# Altium schematic sheet filterbank_amp.SchDoc
size A3
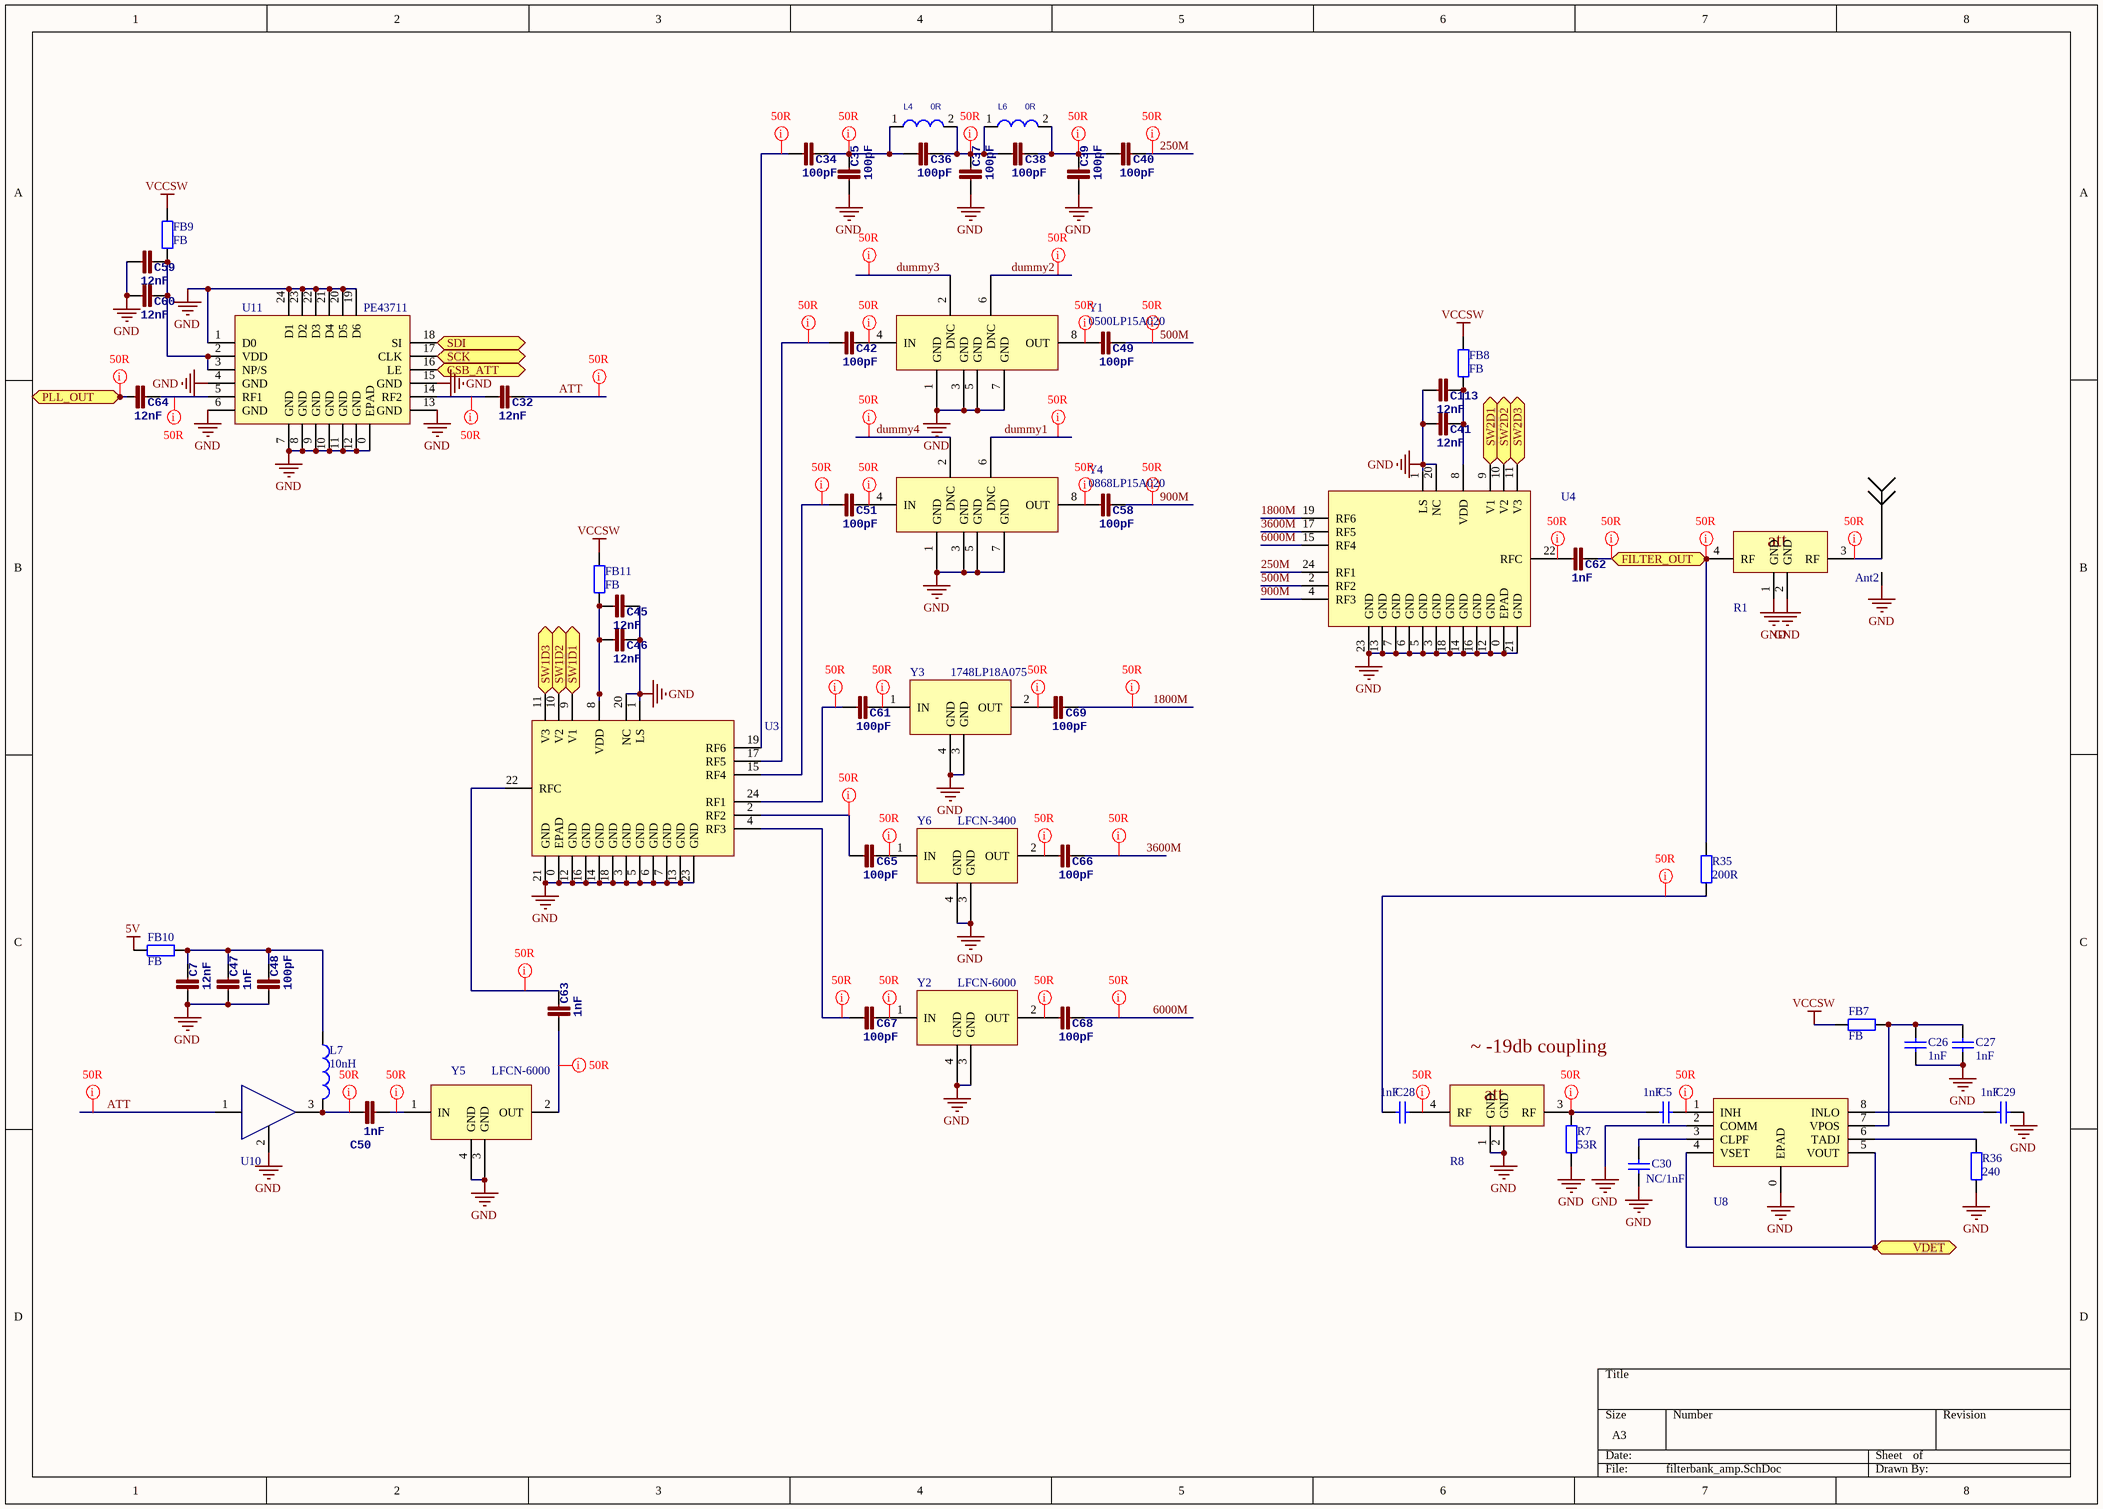
[diagram p0: filterbank_amp.SchDoc]

## Parts
Ant2  Antenna  [SMA-2]  (value not drawn)
C5  1nF  [0402]
C7  12nF  [0805]
C26  1nF  [0402]
C27  1nF  [0402]
C28  1nF  [0402]
C29  1nF  [0402]
C30  NC/1nF  [0402]
C32  12nF  [0402]
C34  100pF  [0402]
C35  100pF  [0402]
C36  100pF  [0402]
C37  100pF  [0402]
C38  100pF  [0402]
C39  100pF  [0402]
C40  100pF  [0402]
C41  12nF  [0402]
C42  100pF  [0402]
C45  12nF  [0402]
C46  12nF  [0402]
C47  1nF  [0402]
C48  100pF  [0402]
C49  100pF  [0402]
C50  1nF  [0402]
C51  100pF  [0402]
C58  100pF  [0402]
C59  12nF  [0402]
C60  12nF  [0402]
C61  100pF  [0402]
C62  1nF  [0402]
C63  1nF  [0402]
C64  12nF  [0402]
C65  100pF  [0402]
C66  100pF  [0402]
C67  100pF  [0402]
C68  100pF  [0402]
C69  100pF  [0402]
C113  12nF  [0402]
FB7  FB  [0402]
FB8  FB  [0402]
FB9  FB  [0402]
FB10  FB  [0402]
FB11  FB  [0402]
L4  0R  [0402]
L6  0R  [0402]
L7  value 10nH  [0402]  (hidden comment: Inductor)
R1  EXB24-RF-ATT  [EXB24AT-RF-ATT]  (value not drawn)
R7  53R  [0402]
R8  EXB24-RF-ATT  [EXB24AT-RF-ATT]  (value not drawn)
R35  200R  [0402]
R36  240  [0402]
U3  PE42462  [PE42462]  (value not drawn)
U4  PE42462  [PE42462]  (value not drawn)
U8  AD8319  [AD8319]  (value not drawn)
U10  AMP-SOT89  [SOT-89]  (value not drawn)
U11  PE43711  [PE43711]
Y1  0500LP15A020  [5515LP15A730/0868LP15A020]
Y2  LFCN-6000  [1748LP18A075]
Y3  1748LP18A075  [1748LP18A075]
Y4  0868LP15A020  [5515LP15A730/0868LP15A020]
Y5  LFCN-6000  [1748LP18A075]
Y6  LFCN-3400  [1748LP18A075]

## Ports
CSB_ATT, FILTER_OUT, PLL_OUT, SCK, SDI, SW1D1, SW1D2, SW1D3, SW2D1, SW2D2, SW2D3, VDET

## Nets
5V: FB10.1
GND: Ant2.GND(G) C7.1 C26.1 C27.1 C29.2 C30.1 C35.1 C37.1 C39.1 C41.1 C45.2 C46.2 C47.1 C48.1 C59.1 C60.1 C113.1 R1.1(GND) R1.2(GND) R7.2 R8.1(GND) R8.2(GND) R36.2 U3.0(EPAD) U3.1(LS) U3.3(GND) U3.5(GND) U3.6(GND) U3.7(GND) U3.12(GND) U3.13(GND) U3.14(GND) U3.16(GND) U3.18(GND) U3.20(NC) U3.21(GND) U3.23(GND) U4.0(EPAD) U4.1(LS) U4.3(GND) U4.5(GND) U4.6(GND) U4.7(GND) U4.12(GND) U4.13(GND) U4.14(GND) U4.16(GND) U4.18(GND) U4.20(NC) U4.21(GND) U4.23(GND) U8.0(EPAD) U8.2(COMM) U10.2 U11.0(EPAD) U11.1(D0) U11.4(GND) U11.6(GND) U11.7(GND) U11.8(GND) U11.9(GND) U11.10(GND) U11.11(GND) U11.12(GND) U11.13(GND) U11.15(GND) U11.19(D6) U11.20(D5) U11.21(D4) U11.22(D3) U11.23(D2) U11.24(D1) Y1.1(GND) Y1.3(GND) Y1.5(GND) Y1.7(GND) Y2.3(GND) Y2.4(GND) Y3.3(GND) Y3.4(GND) Y4.1(GND) Y4.3(GND) Y4.5(GND) Y4.7(GND) Y5.3(GND) Y5.4(GND) Y6.3(GND) Y6.4(GND)
VCCSW: FB7.1 FB8.2 FB9.2 FB11.2
250M: C40.2 U4.24(RF1)
500M: C49.2 U4.2(RF2)
900M: C58.2 U4.4(RF3)
1800M: C69.2 U4.19(RF6)
3600M: C66.2 U4.17(RF5)
6000M: C68.2 U4.15(RF4)
ATT: C32.2 U10.1
CSB_ATT: U11.16(LE) ; port CSB_ATT
dummy1: Y4.6(DNC)
dummy2: Y1.6(DNC)
dummy3: Y1.2(DNC)
dummy4: Y4.2(DNC)
FILTER_OUT: C62.2 R1.4(RF) R35.1 ; port FILTER_OUT
PLL_OUT: C64.1 ; port PLL_OUT
SCK: U11.17(CLK) ; port SCK
SDI: U11.18(SI) ; port SDI
SW1D1: U3.9(V1) ; port SW1D1
SW1D2: U3.10(V2) ; port SW1D2
SW1D3: U3.11(V3) ; port SW1D3
SW2D1: U4.9(V1) ; port SW2D1
SW2D2: U4.10(V2) ; port SW2D2
SW2D3: U4.11(V3) ; port SW2D3
VDET: U8.4(VSET) U8.5(VOUT) ; port VDET
NetAnt2_1: Ant2.1 R1.3(RF)
NetC5_1: C5.1 R7.1 R8.3(RF)
NetC5_2: C5.2 U8.1(INH)
NetC7_2: C7.2 C47.2 C48.2 FB10.2 L7.1
NetC26_2: C26.2 C27.2 FB7.2 U8.7(VPOS)
NetC28_1: C28.1 R35.2
NetC28_2: C28.2 R8.4(RF)
NetC29_1: C29.1 U8.8(INLO)
NetC30_2: C30.2 U8.3(CLPF)
NetC32_1: C32.1 U11.14(RF2)
NetC34_1: C34.1 U3.19(RF6)
NetC34_2: C34.2 C35.2 C36.1 L4.1
NetC36_2: C36.2 C37.2 C38.1 L4.2 L6.1
NetC38_2: C38.2 C39.2 C40.1 L6.2
NetC41_2: C41.2 C113.2 FB8.1 U4.8(VDD)
NetC42_1: C42.1 U3.17(RF5)
NetC42_2: C42.2 Y1.4(IN)
NetC45_1: C45.1 C46.1 FB11.1 U3.8(VDD)
NetC49_1: C49.1 Y1.8(OUT)
NetC50_1: C50.1 L7.2 U10.3
NetC50_2: C50.2 Y5.1(IN)
NetC51_1: C51.1 U3.15(RF4)
NetC51_2: C51.2 Y4.4(IN)
NetC58_1: C58.1 Y4.8(OUT)
NetC59_2: C59.2 C60.2 FB9.1 U11.2(VDD) U11.3(NP/S)
NetC61_1: C61.1 U3.24(RF1)
NetC61_2: C61.2 Y3.1(IN)
NetC62_1: C62.1 U4.22(RFC)
NetC63_1: C63.1 Y5.2(OUT)
NetC63_2: C63.2 U3.22(RFC)
NetC64_2: C64.2 U11.5(RF1)
NetC65_1: C65.1 U3.2(RF2)
NetC65_2: C65.2 Y6.1(IN)
NetC66_1: C66.1 Y6.2(OUT)
NetC67_1: C67.1 U3.4(RF3)
NetC67_2: C67.2 Y2.1(IN)
NetC68_1: C68.1 Y2.2(OUT)
NetC69_1: C69.1 Y3.2(OUT)
NetR36_1: R36.1 U8.6(TADJ)

## Layout directives
net class 50R: 250M, 500M, 900M, 1800M, 3600M, 6000M, ATT, dummy1, dummy2, dummy3, dummy4, FILTER_OUT, NetAnt2_1, NetC5_1, NetC5_2, NetC28_1, NetC28_2, NetC32_1, NetC34_1, NetC34_2, NetC36_2, NetC38_2, NetC42_1, NetC42_2, NetC49_1, NetC50_1, NetC50_2, NetC51_1, NetC51_2, NetC58_1, NetC61_1, NetC61_2, NetC62_1, NetC63_1, NetC63_2, NetC64_2, NetC65_1, NetC65_2, NetC66_1, NetC67_1, NetC67_2, NetC68_1, NetC69_1, PLL_OUT

## Notes on the sheet
- ~ -19db coupling
- (in symbol EXB24-RF-ATT) att

## Library data of the parts
C5 C26-C30 = Cap: Capacitor; Published: 8-Jun-2000; LatestRevisionDate: 17-Jul-2002; LatestRevisionNote: Re-released for DXP Platform.; PackageReference: RAD-0.3; Publisher: Altium Limited; PackageDescription: Radial Cap, Thru-Hole; 2 Leads; 0.3 in Pin Spacing
C7 C32 C34-C42 C45-C51 C58-C69 C113 = CAP0402-CAP: <b>Capacitor</b> / Standard 0603 ceramic capacitor, and 0.1" leaded capacitor.; PARTNO: CC0402ZRY5V7BB104
FB7-FB11 R7 R35 R36 = Res2: Resistor; Published: 8-Jun-2000; LatestRevisionDate: 17-Jul-2002; LatestRevisionNote: Re-released for DXP Platform.; PackageReference: AXIAL-0.4; Publisher: Altium Limited; PackageDescription: Axial Device, Thru-Hole; 2 Leads; 0.4 in Pin Spacing
L4 L6 = L/2.5*2.0
L7 = Inductor: Code_IEC: 1005; Published: 8-Jun-2000; LatestRevisionDate: 29-May-2009; LatestRevisionNote: IPC-7351 Footprint Added.; PackageReference: 0402-A; Publisher: Altium Limited; PackageDescription: Chip Inductor; Code_JEITA: 0402
Y1 Y4 = 5515LP15A730/0868LP15A020
Y2 Y5 Y6 = 1748LP18A075